# Altium schematic sheet B38_Buzzer.SchDoc
size A4; SheetNumber: 7; SheetTotal: 11
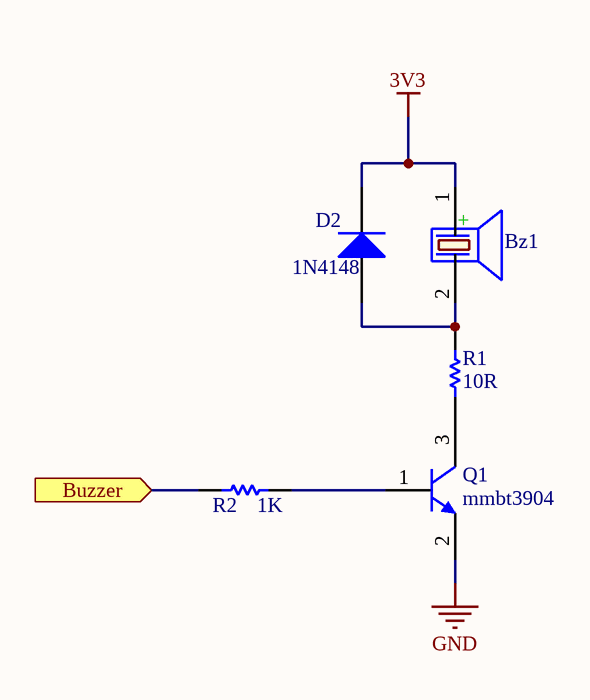
[diagram p0: B38_Buzzer.SchDoc]

## Parts
Bz1  Buzzer  [Buzzer]  (value not drawn)
D2  1N4148  [SOD-123]
Q1  mmbt3904  [SOT-23]
R1  10R  [RES0603]
R2  1K  [RES0603]

## Ports
Buzzer (in)

## Nets
3V3: Bz1.1(+) D2.2(K)
GND: Q1.2(E)
Buzzer: R2.2 ; port Buzzer
NetBz1_2: Bz1.2(-) D2.1(A) R1.1
NetQ1_1: Q1.1(B) R2.1
NetQ1_3: Q1.3(C) R1.2

## Library data of the parts
Bz1 = PIEZO BUZZER: PIEZO BUZZER ACTIVE; Manufacturer: HNDZ; PN: MLT-7525; Value: Buzzer
D2 = Diode 1N4148: High Conductance Fast Diode; Manufacturer: VISHAY; PN: 1N4148WS; Value: 1N4148WS
R1 = Res1: Resistor 5%; Manufacturer: Panasonic; PN: ERJ3GEYJ101V; Value: 100Ω
R2 = Res1: Resistor 5%; Manufacturer: Panasonic; PN: ERJ3GEYJ102V; Value: 1KΩ